# Altium schematic sheet SX1278_STM32.SchDoc
size A3
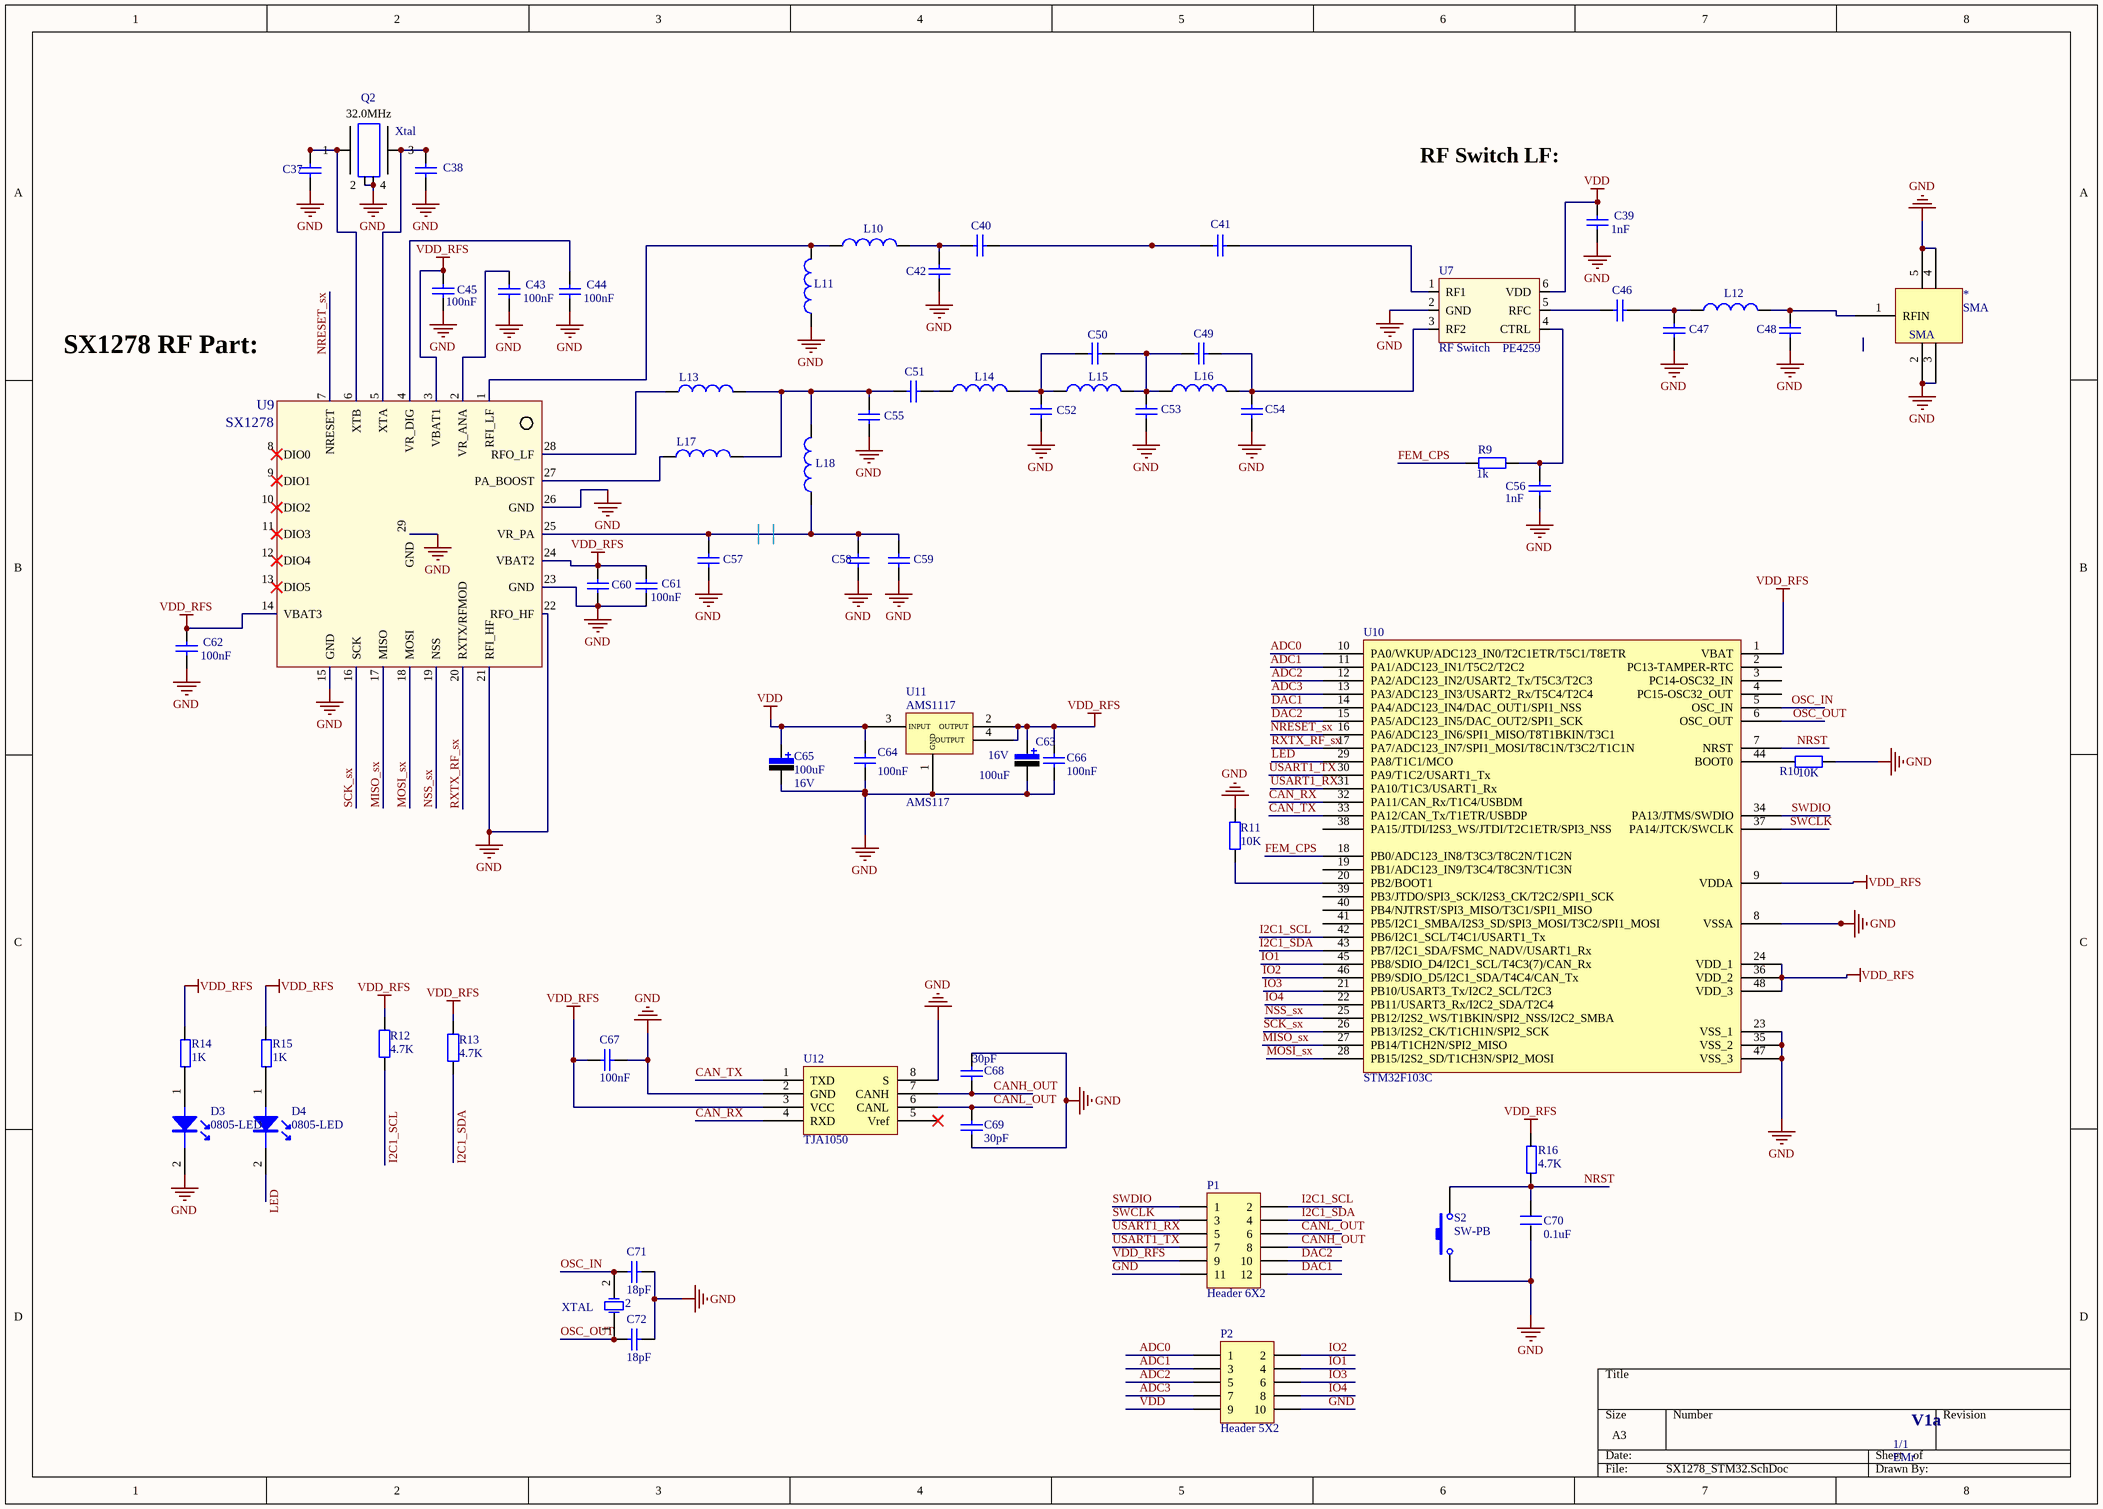
[diagram p0: SX1278_STM32.SchDoc]

## Parts
2  XTAL  [X-HC49U]
*  SMA  [SMA]
C37  Cap  [0603-2]  (value not drawn)
C38  Cap  [0603-2]  (value not drawn)
C39  value 1nF  [0603-2]  (hidden comment: Cap)
C40  Cap  [0603-2]  (value not drawn)
C41  Cap  [0603-2]  (value not drawn)
C42  Cap  [0603-2]  (value not drawn)
C43  value 100nF  [0603-2]  (hidden comment: Cap)
C44  value 100nF  [0603-2]  (hidden comment: Cap)
C45  value 100nF  [0603-2]  (hidden comment: Cap)
C46  Cap  [0603-2]  (value not drawn)
C47  Cap  [0603-2]  (value not drawn)
C48  Cap  [0603-2]  (value not drawn)
C49  Cap  [0603-2]  (value not drawn)
C50  Cap  [0603-2]  (value not drawn)
C51  Cap  [0603-2]  (value not drawn)
C52  Cap  [0603-2]  (value not drawn)
C53  Cap  [0603-2]  (value not drawn)
C54  Cap  [0603-2]  (value not drawn)
C55  Cap  [0603-2]  (value not drawn)
C56  value 1nF  [0603-2]  (hidden comment: Cap)
C57  Cap  [0603-2]  (value not drawn)
C58  Cap  [0603-2]  (value not drawn)
C59  Cap  [0603-2]  (value not drawn)
C60  Cap  [0603-2]  (value not drawn)
C61  value 100nF  [0603-2]  (hidden comment: Cap)
C62  value 100nF  [0603-2]  (hidden comment: Cap)
C63  value 100uF  Vol: 16V  [CAP-6032]  (hidden comment: Cap Pol)
C64  value 100nF  [0603-2]  (hidden comment: Cap)
C65  value 100uF  Vol: 16V  [CAP-6032]  (hidden comment: Cap Pol)
C66  value 100nF  [0603-2]  (hidden comment: Cap)
C67  value 100nF  [0603-2]  (hidden comment: Cap)
C68  value 30pF  [0603-2]  (hidden comment: Cap)
C69  value 30pF  [0603-2]  (hidden comment: Cap)
C70  0.1uF  [0603-2]
C71  value 18pF  [0603-2]  (hidden comment: Cap)
C72  value 18pF  [0603-2]  (hidden comment: Cap)
D3  0805-LED  [LED_0805]
D4  0805-LED  [LED_0805]
L10  Inductor  [0603-2]  (value not drawn)
L11  Inductor  [0603-2]  (value not drawn)
L12  Inductor  [0603-2]  (value not drawn)
L13  Inductor  [0603-2]  (value not drawn)
L14  Inductor  [0603-2]  (value not drawn)
L15  Inductor  [0603-2]  (value not drawn)
L16  Inductor  [0603-2]  (value not drawn)
L17  Inductor  [0603-2]  (value not drawn)
L18  Inductor  [0603-2]  (value not drawn)
P1  Header 6X2  [HDR2X6]
P2  Header 5X2  [HDR2X5]
Q2  Xtal  value 32.0MHz  [X-CPX35]
R9  value 1k  [0603-2]  (hidden comment: Resistor)
R10  value 10K  [0603-2]  (hidden comment: Res1)
R11  value 10K  [0603-2]  (hidden comment: Res1)
R12  value 4.7K  [0603-2]  (hidden comment: Res1)
R13  value 4.7K  [0603-2]  (hidden comment: Res1)
R14  1K  [0603-2]
R15  1K  [0603-2]
R16  4.7K  [0603-2]
S2  SW-PB  [SW_PB2_A1]
U7  RF Switch  value PE4259  [SC70-6]
U9  SX1278  [vqfn28_6x6mm]
U10  STM32F103C  [STM32F103C8T6]
U11  AMS117  [AMS1117]
U12  TJA1050  [VP230]

## Nets
GND: *.2 *.3 *.4 *.5 C37.1 C38.1 C39.1 C42.1 C43.1 C44.1 C45.1 C47.1 C48.1 C52.1 C53.1 C54.1 C55.1 C56.2 C57.1 C58.1 C59.1 C60.1 C61.1 C62.1 C63.2 C64.1 C65.2 C66.1 C67.2 C68.2 C69.1 C70.1 C71.2 C72.2 D3.2 L11.1 P1.11 P2.10 Q2.2 Q2.4 R10.2 R11.2 S2.1 U7.2(GND) U9.15(GND) U9.21(RFI_HF) U9.22(RFO_HF) U9.23(GND) U9.26(GND) U9.29(GND) U10.8(VSSA) U10.23(VSS_1) U10.35(VSS_2) U10.47(VSS_3) U11.1(GND) U12.2(GND) U12.8(S)
VDD: C39.2 C64.2 C65.1 P2.9 U7.6(VDD) U11.3(INPUT)
VDD_RFS: C45.2 C60.2 C61.2 C62.2 C63.1 C66.2 C67.1 P1.9 R12.2 R13.2 R14.2 R15.2 R16.2 U9.3(VBAT1) U9.14(VBAT3) U9.24(VBAT2) U10.1(VBAT) U10.9(VDDA) U10.24(VDD_1) U10.36(VDD_2) U10.48(VDD_3) U11.2(OUTPUT) U11.4(OUTPUT) U12.3(VCC)
ADC0: P2.1 U10.10(PA0/WKUP/ADC123_IN0/T2C1ETR/T5C1/T8ETR)
ADC1: P2.3 U10.11(PA1/ADC123_IN1/T5C2/T2C2)
ADC2: P2.5 U10.12(PA2/ADC123_IN2/USART2_Tx/T5C3/T2C3)
ADC3: P2.7 U10.13(PA3/ADC123_IN3/USART2_Rx/T5C4/T2C4)
CAN_RX: U10.32(PA11/CAN_Rx/T1C4/USBDM) U12.4(RXD)
CAN_TX: U10.33(PA12/CAN_Tx/T1ETR/USBDP) U12.1(TXD)
CANH_OUT: C68.1 P1.8 U12.7(CANH)
CANL_OUT: C69.2 P1.6 U12.6(CANL)
DAC1: P1.12 U10.14(PA4/ADC123_IN4/DAC_OUT1/SPI1_NSS)
DAC2: P1.10 U10.15(PA5/ADC123_IN5/DAC_OUT2/SPI1_SCK)
FEM_CPS: R9.2 U10.18(PB0/ADC123_IN8/T3C3/T8C2N/T1C2N)
I2C1_SCL: P1.2 R12.1 U10.42(PB6/I2C1_SCL/T4C1/USART1_Tx)
I2C1_SDA: P1.4 R13.1 U10.43(PB7/I2C1_SDA/FSMC_NADV/USART1_Rx)
IO1: P2.4 U10.45(PB8/SDIO_D4/I2C1_SCL/T4C3(7)/CAN_Rx)
IO2: P2.2 U10.46(PB9/SDIO_D5/I2C1_SDA/T4C4/CAN_Tx)
IO3: P2.6 U10.21(PB10/USART3_Tx/I2C2_SCL/T2C3)
IO4: P2.8 U10.22(PB11/USART3_Rx/I2C2_SDA/T2C4)
LED: D4.2 U10.29(PA8/T1C1/MCO)
MISO_sx: U9.17(MISO) U10.27(PB14/T1CH2N/SPI2_MISO)
MOSI_sx: U9.18(MOSI) U10.28(PB15/I2S2_SD/T1CH3N/SPI2_MOSI)
NRESET_sx: U9.7(NRESET) U10.16(PA6/ADC123_IN6/SPI1_MISO/T8T1BKIN/T3C1)
NRST: C70.2 R16.1 S2.2 U10.7(NRST)
NSS_sx: U9.19(NSS) U10.25(PB12/I2S2_WS/T1BKIN/SPI2_NSS/I2C2_SMBA)
OSC_IN: 2.2(OSC2) C71.1 U10.5(OSC_IN)
OSC_OUT: 2.1(OSC1) C72.1 U10.6(OSC_OUT)
RXTX_RF_sx: U9.20(RXTX/RFMOD) U10.17(PA7/ADC123_IN7/SPI1_MOSI/T8C1N/T3C2/T1C1N)
SCK_sx: U9.16(SCK) U10.26(PB13/I2S2_CK/T1CH1N/SPI2_SCK)
SWCLK: P1.3 U10.37(PA14/JTCK/SWCLK)
SWDIO: P1.1 U10.34(PA13/JTMS/SWDIO)
USART1_RX: P1.5 U10.31(PA10/T1C3/USART1_Rx)
USART1_TX: P1.7 U10.30(PA9/T1C2/USART1_Tx)
Net*_1: *.1(RFIN) C48.2 L12.2
NetC37_2: C37.2 Q2.1 U9.6(XTB)
NetC38_2: C38.2 Q2.3 U9.5(XTA)
NetC40_1: C40.1 C41.2
NetC40_2: C40.2 C42.2 L10.2
NetC41_1: C41.1 U7.1(RF1)
NetC43_2: C43.2 U9.2(VR_ANA)
NetC44_2: C44.2 U9.4(VR_DIG)
NetC46_1: C46.1 C47.2 L12.1
NetC46_2: C46.2 U7.5(RFC)
NetC49_1: C49.1 C54.2 L16.2 U7.3(RF2)
NetC49_2: C49.2 C50.1 C53.2 L15.2 L16.1
NetC50_2: C50.2 C52.2 L14.2 L15.1
NetC51_1: C51.1 L14.1
NetC51_2: C51.2 C55.2 L13.2 L17.2 L18.2
NetC56_1: C56.1 R9.1 U7.4(CTRL)
NetC57_2: C57.2 C58.2 C59.2 L18.1 U9.25(VR_PA)
NetD3_1: D3.1 R14.1
NetD4_1: D4.1 R15.1
NetL10_1: L10.1 L11.2 U9.1(RFI_LF)
NetL13_1: L13.1 U9.28(RFO_LF)
NetL17_1: L17.1 U9.27(PA_BOOST)
NetR10_1: R10.1 U10.44(BOOT0)
NetR11_1: R11.1 U10.20(PB2/BOOT1)

Not connected (* = marked no-connect by the designer): U9 8(DIO0)* 9(DIO1)* 10(DIO2)* 11(DIO3)* 12(DIO4)* 13(DIO5)*; U10 2(PC13-TAMPER-RTC) 3(PC14-OSC32_IN) 4(PC15-OSC32_OUT) 19(PB1/ADC123_IN9/T3C4/T8C3N/T1C3N) 38(PA15/JTDI/I2S3_WS/JTDI/T2C1ETR/SPI3_NSS) 39(PB3/JTDO/SPI3_SCK/I2S3_CK/T2C2/SPI1_SCK) 40(PB4/NJTRST/SPI3_MISO/T3C1/SPI1_MISO) 41(PB5/I2C1_SMBA/I2S3_SD/SPI3_MOSI/T3C2/SPI1_MOSI); U12 5(Vref)*

## Notes on the sheet
- RF Switch LF:
- (near U9) SX1278 RF Part:
- 1/1
- EMr
- V1a
- (in symbol AMS117) AMS1117

## Library data of the parts
2 = XTAL: Crystal Oscillator; Published: 8-Jun-2000; LatestRevisionDate: 17-Jul-2002; LatestRevisionNote: Re-released for DXP Platform.; PackageReference: R38; Publisher: Altium Limited; PackageDescription: Crystal, Thru-Hole; 2 Leads; Body 3.1 x 8.2 mm (Dia.xH)
C37 = Cap: Capacitor SMD; Value: 18pnF; Published: 8-Jun-2000; LatestRevisionDate: 05-oct-2007  -  Semtech; LatestRevisionNote: Re-released for DXP Platform.; Publisher: Altium Limited
C38 = Cap: Capacitor SMD; Value: 18pF; Published: 8-Jun-2000; LatestRevisionDate: 05-oct-2007  -  Semtech; LatestRevisionNote: Re-released for DXP Platform.; Publisher: Altium Limited
C39 C43-C45 C56 C61 C62 = Cap: Capacitor SMD; Published: 8-Jun-2000; LatestRevisionDate: 05-oct-2007  -  Semtech; LatestRevisionNote: Re-released for DXP Platform.; Publisher: Altium Limited
C40-C42 C46 C49-C53 C55 C57-C59 = Cap: Capacitor SMD; Value: 100nF; Published: 8-Jun-2000; LatestRevisionDate: 05-oct-2007  -  Semtech; LatestRevisionNote: Re-released for DXP Platform.; Publisher: Altium Limited
C47 C48 C54 = Cap: Capacitor SMD; Value: NC; Published: 8-Jun-2000; LatestRevisionDate: 05-oct-2007  -  Semtech; LatestRevisionNote: Re-released for DXP Platform.; Publisher: Altium Limited
C60 = Cap: Capacitor SMD; Value: 100pF; Published: 8-Jun-2000; LatestRevisionDate: 05-oct-2007  -  Semtech; LatestRevisionNote: Re-released for DXP Platform.; Publisher: Altium Limited
C63 C65 = Cap Pol: 极性电解电容; Published: 8-Jun-2000; LatestRevisionDate: 17-Jul-2002; LatestRevisionNote: Re-released for DXP Platform.; PackageReference: RB7.6-15; Publisher: Altium Limited
C64 C66-C69 C71 C72 = Cap: 无极性电容; Published: 8-Jun-2000; LatestRevisionDate: 17-Jul-2002; LatestRevisionNote: Re-released for DXP Platform.; PackageReference: RAD-0.3; Publisher: Altium Limited
C70 = C
L10 L11 L13-L15 L17 L18 = Inductor: Inductor SMD; Code_IEC: 1005; Value: VAL?; Published: 8-Jun-2000; LatestRevisionDate: 05-oct-2007  -  Semtech; LatestRevisionNote: Re-released for DXP Platform.; Publisher: Altium Limited; Code_JEITA: 0402
L12 L16 = Inductor: Inductor SMD; Code_IEC: 1005; Value: 0R; Published: 8-Jun-2000; LatestRevisionDate: 05-oct-2007  -  Semtech; LatestRevisionNote: Re-released for DXP Platform.; Publisher: Altium Limited; Code_JEITA: 0402
P1 = Header 6X2: Header, 6-Pin, Dual row; LatestRevisionDate: 17-Jul-2002; LatestRevisionNote: Re-released for DXP Platform.; Publisher: Altium Limited
P2 = Header 5X2: Header, 5-Pin, Dual row; LatestRevisionDate: 17-Jul-2002; LatestRevisionNote: Re-released for DXP Platform.; Publisher: Altium Limited
Q2 = Xtal GND: Crystal with GND pins; LatestRevisionDate: 05-oct-2007  -  Semtech
R9 = Resistor: Resistor SMD - IEC symbol version; LatestRevisionDate: 27-Jul-20  -  Semtech
R10-R13 = Res1: 贴片电阻; Published: 8-Jun-2000; LatestRevisionDate: 17-Jul-2002; LatestRevisionNote: Re-released for DXP Platform.; PackageReference: AXIAL-0.4; Publisher: Altium Limited
R14-R16 = R
S2 = SW-PB: 微动开关; Published: 24-Mar-1999; LatestRevisionDate: 17-Jul-2002; LatestRevisionNote: Re-released for DXP Platform.; PackageReference: SPST-2; Publisher: Altium Limited
U7 = PE4259 RF Switch: PE4259 Peregrine RF Switch; LatestRevisionDate: 03-Sep-2012 -  Semtech
U9 = SX1276: SX1276 - Low Power Integrated UHF Transceiver with loRa Modem; LatestRevisionDate: 27-Jul-2009 -  Semtech
U10 = STM32F103C: STM32单片机48引脚